# Altium schematic sheet CPU.SchDoc
size A; PageSetup: Record=PageOptions|CenterHorizontal=True|CenterVertical=True|PrintScale=1.05|XCorrection=1.00|YCorrection=1.00|PrintKind=1|BorderSize=5000000|LeftOffset=0|BottomOffset=0|Orientation=2|PaperLength=1000|PaperWidth=1000|Scale=100|PaperSource=262|PrintQuality=600|MediaType=1|DitherType=10|PaperKind=Letter|PrintScaleMode=1
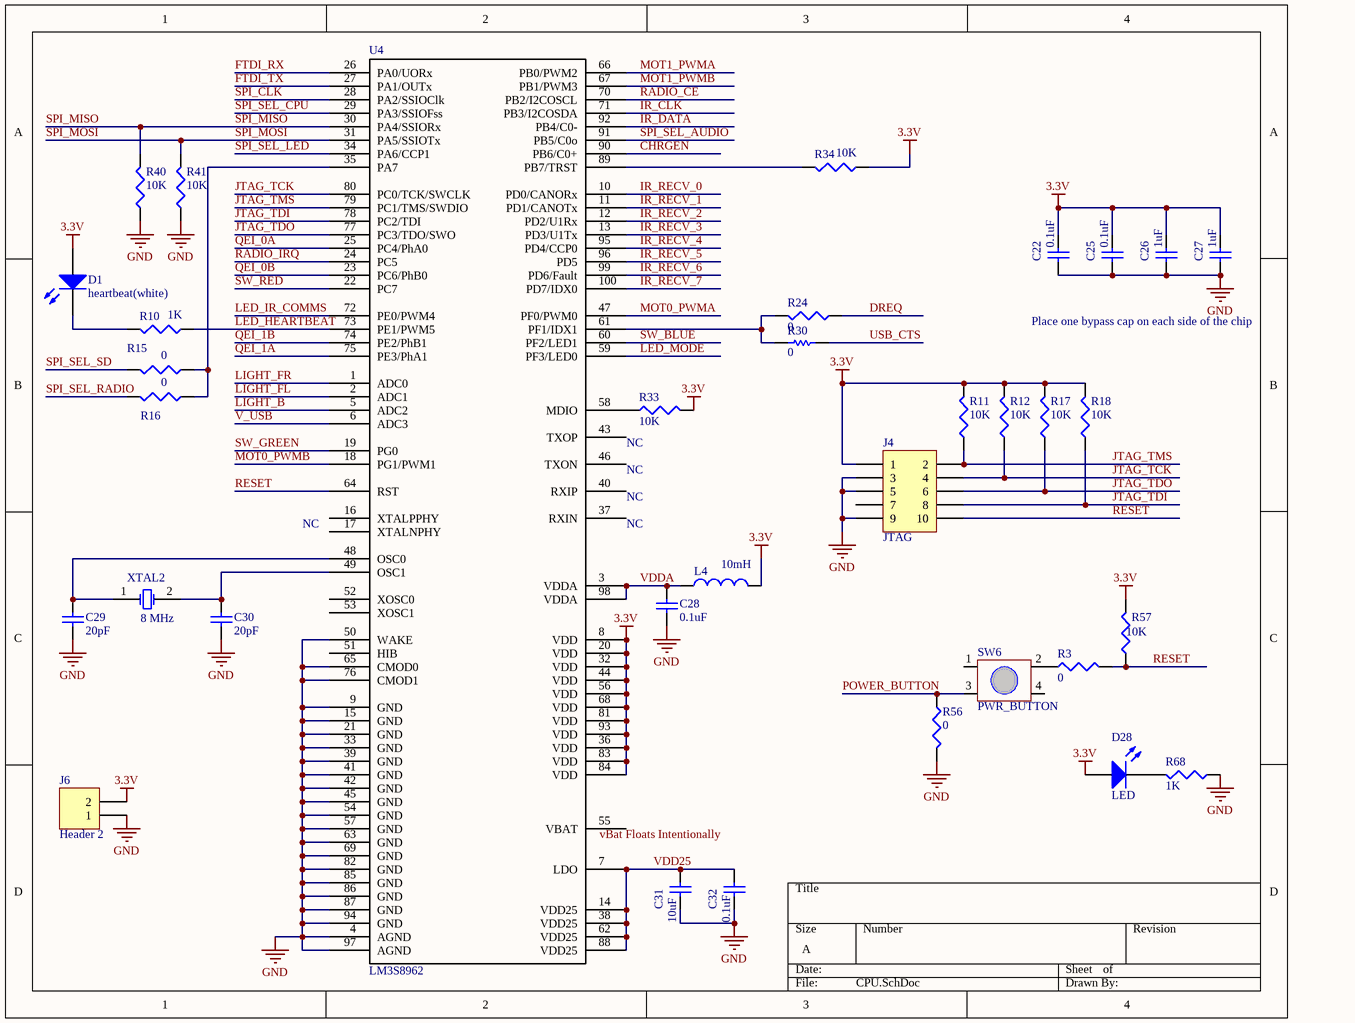
[diagram p0: CPU.SchDoc]

## Parts
C22  value 0.1uF  [CAPC1005L]  (hidden comment: Cap Semi)
C25  value 0.1uF  [CAPC1005L]  (hidden comment: Cap Semi)
C26  value 1uF  [CAPC1608L]  (hidden comment: Cap Semi)
C27  value 1uF  [CAPC1608L]  (hidden comment: Cap Semi)
C28  value 0.1uF  [CAPC1005L]  (hidden comment: Cap Semi)
C29  value 20pF  [CAPC1005L]  (hidden comment: Cap Semi)
C30  value 20pF  [CAPC1005L]  (hidden comment: Cap Semi)
C31  value 10uF  [CAPC1608L]  (hidden comment: Cap Semi)
C32  value 0.1uF  [CAPC1005L]  (hidden comment: Cap Semi)
D1  heartbeat(white)  [INDC2012L]
D28  LED  [SurfaceMount(603)]
J4  JTAG  [JTAG-10]
J6  Header 2  [HDR1X2]
L4  value 10mH  [INDC2012L]  (hidden comment: Inductor)
R3  value 0  [RESC1608L]  (hidden comment: Res3)
R10  value 1K  [RESC1608L]  (hidden comment: Res3)
R11  value 10K  [RESC1608L]  (hidden comment: Res3)
R12  value 10K  [RESC1608L]  (hidden comment: Res3)
R15  value 0  [RESC1608L]  (hidden comment: Res3)
R16  value 0  [RESC1608L]  (hidden comment: Res3)
R17  value 10K  [RESC1608L]  (hidden comment: Res3)
R18  value 10K  [RESC1608L]  (hidden comment: Res3)
R24  value 0  [RESC1608L]  (hidden comment: Res3)
R30  value 0  [RESC1608L]
R33  value 10K  [RESC1608L]  (hidden comment: Res3)
R34  value 10K  [RESC1608L]  (hidden comment: Res3)
R40  value 10K  [RESC1608L]  (hidden comment: Res3)
R41  value 10K  [RESC1608L]  (hidden comment: Res3)
R56  value 0  [RESC1608L]  (hidden comment: Res3)
R57  value 10K  [RESC1608L]  (hidden comment: Res3)
R68  value 1K  [RESC1608L]  (hidden comment: Res3)
SW6  PWR_BUTTON  [SwitchTall-TL330]
U4  LM3S8962  [LQFP-100]
XTAL2  8 MHz  [RESC5025L]

## Nets
3.3V: C22.2 C25.2 C26.2 C27.2 D1.1(A) D28.1(A) J4.1 J6.2 L4.2 R11.2 R12.2 R17.2 R18.2 R33.2 R34.1 R57.2 U4.8(VDD) U4.20(VDD) U4.32(VDD) U4.36(VDD) U4.44(VDD) U4.56(VDD) U4.68(VDD) U4.81(VDD) U4.83(VDD) U4.84(VDD) U4.93(VDD)
GND: C22.1 C25.1 C26.1 C27.1 C28.1 C29.1 C30.1 C31.1 C32.1 J4.3 J4.5 J4.9 J6.1 R40.1 R41.1 R56.2 R68.1 U4.4(AGND) U4.9(GND) U4.15(GND) U4.21(GND) U4.33(GND) U4.39(GND) U4.41(GND) U4.42(GND) U4.45(GND) U4.50(WAKE) U4.54(GND) U4.57(GND) U4.63(GND) U4.65(CMOD0) U4.69(GND) U4.76(CMOD1) U4.82(GND) U4.85(GND) U4.86(GND) U4.87(GND) U4.94(GND) U4.97(AGND)
CHRGEN: U4.90(PB6/C0+)
DREQ: R24.2
FTDI_RX: U4.26(PA0/UORx)
FTDI_TX: U4.27(PA1/OUTx)
IR_CLK: U4.71(PB3/I2COSDA)
IR_DATA: U4.92(PB4/C0-)
IR_RECV_0: U4.10(PD0/CANORx)
IR_RECV_1: U4.11(PD1/CANOTx)
IR_RECV_2: U4.12(PD2/U1Rx)
IR_RECV_3: U4.13(PD3/U1Tx)
IR_RECV_4: U4.95(PD4/CCP0)
IR_RECV_5: U4.96(PD5)
IR_RECV_6: U4.99(PD6/Fault)
IR_RECV_7: U4.100(PD7/IDX0)
JTAG_TCK: J4.4 R12.1 U4.80(PC0/TCK/SWCLK)
JTAG_TDI: J4.8 R18.1 U4.78(PC2/TDI)
JTAG_TDO: J4.6 R17.1 U4.77(PC3/TDO/SWO)
JTAG_TMS: J4.2 R11.1 U4.79(PC1/TMS/SWDIO)
LED_HEARTBEAT: R10.1 U4.73(PE1/PWM5)
LED_IR_COMMS: U4.72(PE0/PWM4)
LED_MODE: U4.59(PF3/LED0)
LIGHT_B: U4.5(ADC2)
LIGHT_FL: U4.2(ADC1)
LIGHT_FR: U4.1(ADC0)
MOT0_PWMA: U4.47(PF0/PWM0)
MOT0_PWMB: U4.18(PG1/PWM1)
MOT1_PWMA: U4.66(PB0/PWM2)
MOT1_PWMB: U4.67(PB1/PWM3)
POWER_BUTTON: R56.1 SW6.3
QEI_0A: U4.25(PC4/PhA0)
QEI_0B: U4.23(PC6/PhB0)
QEI_1A: U4.75(PE3/PhA1)
QEI_1B: U4.74(PE2/PhB1)
RADIO_CE: U4.70(PB2/I2COSCL)
RADIO_IRQ: U4.24(PC5)
RESET: J4.10 R3.2 R57.1 U4.64(RST)
SPI_CLK: U4.28(PA2/SSIOClk)
SPI_MISO: R40.2 U4.30(PA4/SSIORx)
SPI_MOSI: R41.2 U4.31(PA5/SSIOTx)
SPI_SEL_AUDIO: U4.91(PB5/C0o)
SPI_SEL_CPU: U4.29(PA3/SSIOFss)
SPI_SEL_LED: U4.34(PA6/CCP1)
SPI_SEL_RADIO: R16.2
SPI_SEL_SD: R15.2
SW_BLUE: U4.60(PF2/LED1)
SW_GREEN: U4.19(PG0)
SW_RED: U4.22(PC7)
USB_CTS: R30.2
V_USB: U4.6(ADC3)
VDD25: C31.2 C32.2 U4.7(LDO) U4.14(VDD25) U4.38(VDD25) U4.62(VDD25) U4.88(VDD25)
VDDA: C28.2 L4.1 U4.3(VDDA) U4.98(VDDA)
NetC29_2: C29.2 U4.48(OSC0) XTAL2.1(OSC1)
NetC30_2: C30.2 U4.49(OSC1) XTAL2.2(OSC2)
NetD1_2: D1.2(K) R10.2
NetD28_2: D28.2(K) R68.2
NetR3_1: R3.1 SW6.2
NetR15_1: R15.1 R16.1 U4.35(PA7)
NetR24_1: R24.1 R30.1 U4.61(PF1/IDX1)
NetR33_1: R33.1 U4.58(MDIO)
NetR34_2: R34.2 U4.89(PB7/TRST)

Not connected (* = marked no-connect by the designer): J4 7; SW6 1 4; U4 16(XTALPPHY) 17(XTALNPHY) 37(RXIN) 40(RXIP) 43(TXOP) 46(TXON) 51(HIB) 52(XOSC0) 53(XOSC1) 55(VBAT)

## Notes on the sheet
- Place one bypass cap on each side of the chip
- NC
- (near U4) NC
- (near U4) vBat Floats Intentionally

## Library data of the parts
C22 C25-C32 = Cap Semi: Capacitor (Semiconductor SIM Model); Published: 8-Jun-2000; LatestRevisionDate: 29-May-2009; LatestRevisionNote: IPC-7351 Footprint Added.; PackageReference: C1206; Publisher: Altium Limited; PackageDescription: Chip Capacitor
D1 = LED2: Typical RED, GREEN, YELLOW, AMBER GaAs LED; Published: 8-Jun-2000; LatestRevisionDate: 17-Jul-2002; LatestRevisionNote: Re-released for DXP Platform.; PackageVersion: Feb-2002; PackageReference: 3.2X1.6X1.1; Publisher: Altium Limited
J4 = Header 5X2H: Header, 5-Pin, Dual row, Right Angle; LatestRevisionDate: 17-Jul-2002; LatestRevisionNote: Re-released for DXP Platform.; Publisher: Altium Limited
J6 = Header 2: Header, 2-Pin; LatestRevisionDate: 17-Jul-2002; LatestRevisionNote: Re-released for DXP Platform.; Publisher: Altium Limited
L4 = Inductor: Code_IEC: 1005; Published: 8-Jun-2000; LatestRevisionDate: 29-May-2009; LatestRevisionNote: IPC-7351 Footprint Added.; PackageReference: 0402-A; Publisher: Altium Limited; PackageDescription: Chip Inductor; Code_JEITA: 0402
R3 R10-R12 R15-R18 R24 R33 R34 R40 R41 R56 R57 R68 = Res3: Resistor; Published: 8-Jun-2000; LatestRevisionDate: 29-May-2009; LatestRevisionNote: IPC-7351 Footprint Added.; PackageReference: J1-0603; Publisher: Altium Limited; PackageDescription: Chip Resistor
R30 = Res1: Resistor; Published: 8-Jun-2000; LatestRevisionDate: 17-Jul-2002; LatestRevisionNote: Re-released for DXP Platform.; PackageReference: AXIAL-0.3; Publisher: Altium Limited
SW6 = Switch-TL330
XTAL2 = XTAL: Crystal Oscillator; Published: 8-Jun-2000; LatestRevisionDate: 17-Jul-2002; LatestRevisionNote: Re-released for DXP Platform.; PackageReference: R38; Publisher: Altium Limited